# Altium schematic sheet relay_ladder.SchDoc
size A4
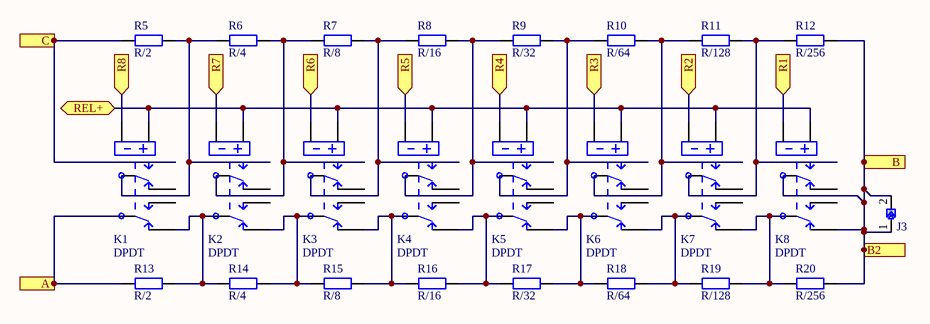
[diagram p0: relay_ladder.SchDoc]

## Parts
J3  solder_jumper  [SOLDER_JUMPER_SQUARE]  (value not drawn)
K1  DPDT  [AXICOM IM-G Relay]
K2  DPDT  [AXICOM IM-G Relay]
K3  DPDT  [AXICOM IM-G Relay]
K4  DPDT  [AXICOM IM-G Relay]
K5  DPDT  [AXICOM IM-G Relay]
K6  DPDT  [AXICOM IM-G Relay]
K7  DPDT  [AXICOM IM-G Relay]
K8  DPDT  [AXICOM IM-G Relay]
R5  R/2  [R2012_0805I_L]
R6  R/4  [R2012_0805I_L]
R7  R/8  [R2012_0805I_L]
R8  R/16  [R2012_0805I_L]
R9  R/32  [R2012_0805I_L]
R10  R/64  [R2012_0805I_L]
R11  R/128  [R2012_0805I_L]
R12  R/256  [R2012_0805I_L]
R13  R/2  [R2012_0805I_L]
R14  R/4  [R2012_0805I_L]
R15  R/8  [R2012_0805I_L]
R16  R/16  [R2012_0805I_L]
R17  R/32  [R2012_0805I_L]
R18  R/64  [R2012_0805I_L]
R19  R/128  [R2012_0805I_L]
R20  R/256  [R2012_0805I_L]

## Ports
A (in), B2 (in), B (in), C (in), R1 (in), R2 (in), R3 (in), R4 (in), R5 (in), R6 (in), R7 (in), R8 (in), REL+ (bidir)

## Nets
A: K1.6 R13.1 ; port A
B: J3.1 J3.2 K8.3 K8.7 R12.2 R20.2 ; port B, port B2
C: K1.4 R5.1 ; port C
R1: K8.8 ; port R1
R2: K7.8 ; port R2
R3: K6.8 ; port R3
R4: K5.8 ; port R4
R5: K4.8 ; port R5
R6: K3.8 ; port R6
R7: K2.8 ; port R7
R8: K1.8 ; port R8
REL+: K1.1 K2.1 K3.1 K4.1 K5.1 K6.1 K7.1 K8.1 ; port REL+
NetK1_3: K1.3 K2.4 R5.2 R6.1
NetK1_7: K1.7 K2.6 R13.2 R14.1
NetK2_3: K2.3 K3.4 R6.2 R7.1
NetK2_7: K2.7 K3.6 R14.2 R15.1
NetK3_3: K3.3 K4.4 R7.2 R8.1
NetK3_7: K3.7 K4.6 R15.2 R16.1
NetK4_3: K4.3 K5.4 R8.2 R9.1
NetK4_7: K4.7 K5.6 R16.2 R17.1
NetK5_3: K5.3 K6.4 R9.2 R10.1
NetK5_7: K5.7 K6.6 R17.2 R18.1
NetK6_3: K6.3 K7.4 R10.2 R11.1
NetK6_7: K6.7 K7.6 R18.2 R19.1
NetK7_3: K7.3 K8.4 R11.2 R12.1
NetK7_7: K7.7 K8.6 R19.2 R20.1

Not connected (* = marked no-connect by the designer): K1 2 5; K2 2 5; K3 2 5; K4 2 5; K5 2 5; K6 2 5; K7 2 5; K8 2 5

## Library data of the parts
K1-K8 = IM-GR Relay DPDT: TE CONNECTIVITY  IM-GR  RELAY, DPDT, NO; Farnell ID: 1175070; URL: http://si.farnell.com/te-connectivity-axicom/im06gr/relay-gull-wing-dpco-12vdc-2a/dp/1175070
R5-R20 = R